# Altium schematic sheet Power Battery Charger.SchDoc: Battery Charger
size 292 x 193 mm; DocumentNumber: 4; SheetNumber: 4; SheetTotal: 40
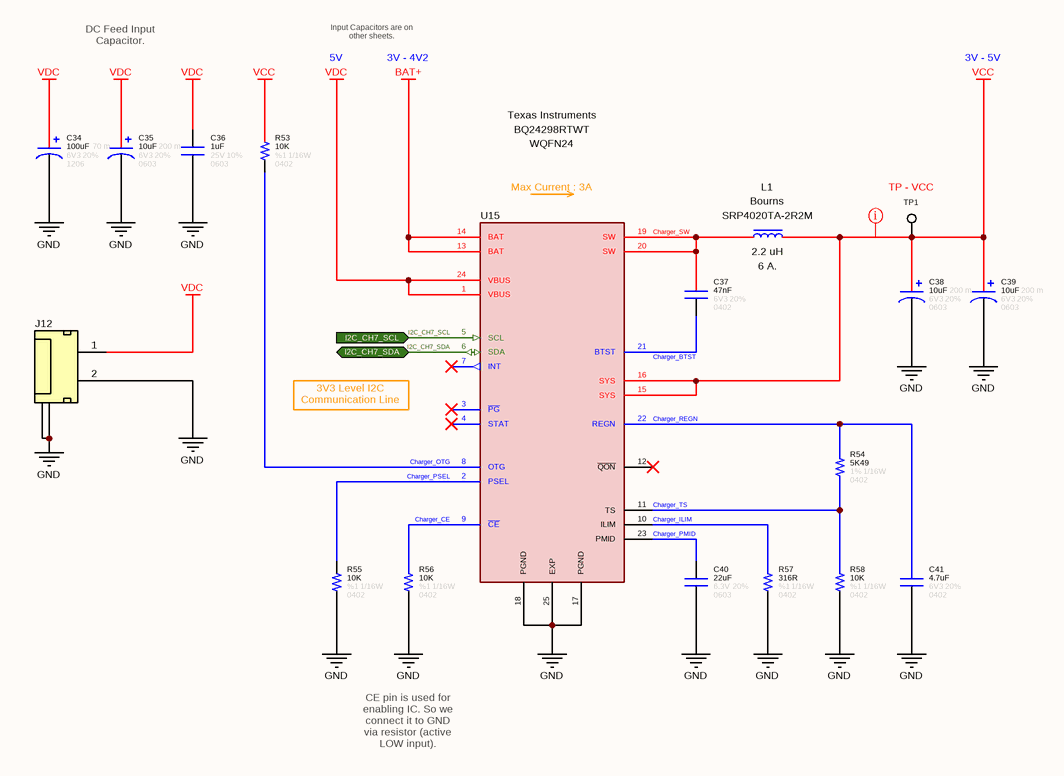
[diagram p0: Power Battery Charger.SchDoc]

## Parts
C34  value 100uF  ESR: 70 m  Tolerance: 20%  Case: 1206  Voltage: 6V3  [CAPACITOR_0603_Tantalum]  (hidden comment: Capacitor - 100uF [1206] (Tantalum))
C35  value 10uF  ESR: 200 m  Tolerance: 20%  Case: 0603  Voltage: 6V3  [CAPACITOR_0603_Tantalum]  (hidden comment: Capacitor - 10uF [0603] (Tantalum))
C36  value 1uF  Tolerance: 10%  Case: 0603  Voltage: 25V  [CAPACITOR_0603]  (hidden comment: Capacitor - 1uF [0603] (Ceramic))
C37  value 47nF  Tolerance: 20%  Case: 0402  Voltage: 6V3  [CAPACITOR_0402]  (hidden comment: Capacitor - 47nF [0402] (Ceramic))
C38  value 10uF  ESR: 200 m  Tolerance: 20%  Case: 0603  Voltage: 6V3  [CAPACITOR_0603_Tantalum]  (hidden comment: Capacitor - 10uF [0603] (Tantalum))
C39  value 10uF  ESR: 200 m  Tolerance: 20%  Case: 0603  Voltage: 6V3  [CAPACITOR_0603_Tantalum]  (hidden comment: Capacitor - 10uF [0603] (Tantalum))
C40  value 22uF  Tolerance: 20%  Case: 0603  Voltage: 6.3V  [CAPACITOR_0603]  (hidden comment: Capacitor - 22uF [0603] (Ceramic))
C41  value 4.7uF  Tolerance: 20%  Case: 0402  Voltage: 6V3  [CAPACITOR_0402]  (hidden comment: Capacitor - 4.7uF [0402] (Ceramic))
J12  2P SMD Tunic Connector  [Connector_Tunic 2P]  (value not drawn)
L1  value 2.2 uH  Manufacturer Name: Bourns  Maximum DC Current: 6 A.  [SRP4020TA]  (hidden comment: SRP4020TA-2R2M)
R53  value 10K  Tolerance: %1  Case: 0402  Power: 1/16W  [RESISTOR_0402]  (hidden comment: 10K - 0402 - %1 - 1/16W)
R54  value 5K49  Power: 1/16W  Case: 0402  Tolerance: 1%  [RESISTOR_0402]  (hidden comment: 5K49 - 0402 - %1 - 1/16W)
R55  value 10K  Tolerance: %1  Case: 0402  Power: 1/16W  [RESISTOR_0402]  (hidden comment: 10K - 0402 - %1 - 1/16W)
R56  value 10K  Tolerance: %1  Case: 0402  Power: 1/16W  [RESISTOR_0402]  (hidden comment: 10K - 0402 - %1 - 1/16W)
R57  value 316R  Power: 1/16W  Case: 0402  Tolerance: %1  [RESISTOR_0402]  (hidden comment: 316R - 0402 - %1 - 1/16W)
R58  value 10K  Tolerance: %1  Case: 0402  Power: 1/16W  [RESISTOR_0402]  (hidden comment: 10K - 0402 - %1 - 1/16W)
TP1  TP - VCC  [TP]  (no BOM)
U15  Manufacturer Name: Texas Instruments  Case: WQFN24  [WQFN-24]  (hidden comment: BQ24298RTWT)

## Ports
I2C_CH7_SCL (in), I2C_CH7_SDA (bidir)

## Nets
BAT+: U15.13(BAT) U15.14(BAT)
GND: C34.2 C35.2 C36.1 C38.2 C39.2 C40.1 C41.1 J12.2(Pin2) J12.3(GND) J12.4(GND) R55.1 R56.1 R57.1 R58.1 U15.17(PGND) U15.18(PGND) U15.25(EXP)
VCC: C38.1 C39.1 L1.2 R53.2 TP1.1 U15.15(SYS) U15.16(SYS)
VDC: C34.1 C35.1 C36.2 J12.1(Pin1) U15.1(VBUS) U15.24(VBUS)
Charger_BTST: C37.1 U15.21(BTST)
Charger_CE: R56.2 U15.9(~{CE})
Charger_ILIM: R57.2 U15.10(ILIM)
Charger_OTG: R53.1 U15.8(OTG)
Charger_PMID: C40.2 U15.23(PMID)
Charger_PSEL: R55.2 U15.2(PSEL)
Charger_REGN: C41.2 R54.2 U15.22(REGN)
Charger_SW: C37.2 L1.1 U15.19(SW) U15.20(SW)
Charger_TS: R54.1 R58.2 U15.11(TS)
I2C_CH7_SCL: U15.5(SCL) ; port I2C_CH7_SCL
I2C_CH7_SDA: U15.6(SDA) ; port I2C_CH7_SDA

Not connected (* = marked no-connect by the designer): U15 3(~{PG})* 4(STAT)* 7(INT)* 12(~{QON})*

## Layout directives
rule Supply Nets [Voltage = 3.000]: VCC

## Notes on the sheet
- DC Feed Input Capacitor.
- 5V
- Input Capacitors are on other sheets.
- 3V - 4V2
- 3V - 5V
- 3V3 Level I2C
  Communication Line
- CE pin is used for enabling IC. So we connect it to GND via resistor (active LOW input).
- © 2021 All rights reserved.
  This document may not, in whole or in part, be copied, photocopied, reproduced, translated or converted to any electronic or machine readable from without prior written permission of Mehmet Günce Akkoyun.
  Engineer contact : akkoyun@me.com
- Property of
- Engineer :
- Date :
- Size :
- A4
- Time :
- Project :
- Page :
- /
- Customer :
- Product ID :
- Module ID :
- Version :
- File :
- Revision :
- (in symbol IC - BQ24298RTWT) Max Current : 3A

## Library data of the parts
C34 = Capacitor - 100uF [1206-6V3] (Tantalium): Tantalum Capacitors - Polymer 6.3V 100uF 1206 20% ESR=70mOhms; Manufacturer Name: KEMET; Manufacturer Part Number: T527I107M006ATE070
C35 C38 C39 = Capacitor - 10uF [0603-6V3] (Tantalium): Capacitor - 10uF [0603] (Tantalium); Manufacturer Name: AVX; Manufacturer Part Number: F380J106MMAAH3; ComponentLink1Description: DataSheet; ComponentLink1URL: https://www.mouser.com.tr/datasheet/2/40/f38-775706.pdf; ComponentLink2Description: Mouser; ComponentLink2URL: https://www.mouser.com.tr/ProductDetail/AVX/F380J106MMAAH3?qs=sGAEpiMZZMtZ1n0r9vR22fixilZl6Mr8zRKleESmvcDFwZ4LSyC6Pg%3D%3D
C36 = Capacitor - 1uF [0603-25V]: Multilayer Ceramic Capacitors - SMD - 25V 1uF X7R 0603 10%; Manufacturer Part Number: GCJ188R71E105KA01D; Manufacturer Name: Murata
C37 = Capacitor - 47nF [0402-6V3]: Multilayer Ceramic Capacitors - SMD - 6.3V 47nF X7R 0402 10%; Manufacturer Name: AVX; Manufacturer Part Number: 04026C472MAT2A
C40 = Capacitor - 22uF [0603-6V3]: Multilayer Ceramic Capacitors - SMD - 6V3 22uF X5R 0603 20%; Manufacturer Part Number: GRM188R60J226MEA0D; Manufacturer Name: Murata
C41 = Capacitor - 4.7uF [0402-6V3]: Multilayer Ceramic Capacitors - SMD - 6V3 4.7uF X5R 0402 20%; Manufacturer Part Number: C0402C475M9PACTU; Manufacturer Name: KEMET
J12 = Connector - Mini Tunic 2P (1.25): Mini Tunic Connector with 2P; Manufacturer Name: Molex; Manufacturer Part Number: 53261-0271; Height: 3.55mm; Mouser Part Number: 538-53261-0271; ROHS: Yes; System: Connector
L1 = Inductor - SRP4020TA-2R2M: 6 A. 2.2uH Power inducator, 20% tol, SMD, RoHS; Maximum DC Resistance: 61 mOhms; Core Material: Carbonyl Powder; Maximum Operating Temperature: +150 C; ROHS: Yes; Tolerance: 20%; Minimum Operating Temperature: -40 C; Height: 1.8mm; Product Type: Fixed Inductors; Case: SMD; Manufacturer Part Number: SRP4020TA-2R2M
R53 R55 R56 R58 = Resistor - 10K [0402]: Thick Film Resistors - SMD 1/16 W 10 KOhm 1%; Manufacturer Name: Vishay; Manufacturer Part Number: CRCW040210K0FKED; ComponentLink1Description: DataSheet; ComponentLink1URL: https://www.mouser.com.tr/datasheet/2/427/dcrcwe3-1762152.pdf; ComponentLink2Description: Mouser; ComponentLink2URL: https://www.mouser.com.tr/ProductDetail/Vishay-Dale/CRCW040210K0FKED?qs=sGAEpiMZZMu61qfTUdNhG2DpbjADlD3GcalbOv9utCY%3D
R54 = Resistor - 5K49 [0402]: Thick Film Resistors - SMD 1/16 W 5.49 KOhm 1%; Manufacturer Name: Vishay; Manufacturer Part Number: CRCW04025K49FKED
R57 = Resistor - 316R [0402]: Thick Film Resistors - SMD 1/16 W 316 Ohm 1%; Manufacturer Name: Vishay; Manufacturer Part Number: CRCW0402316RFKED
TP1 = PCB - Test Point: Test Point
U15 = IC - BQ24298RTWT: I2C Controlled 3A Single Cell Charger; Operating Supply Current: 3 A.; Maximum Operating Temperature: +85; Minimum Operating Temperature: -40; ROHS: Yes; Product Type: Charge Management IC; Manufacturer Part Number: BQ24298RTWT